# EAGLE schematic esplash (EAGLE 9.2.2)
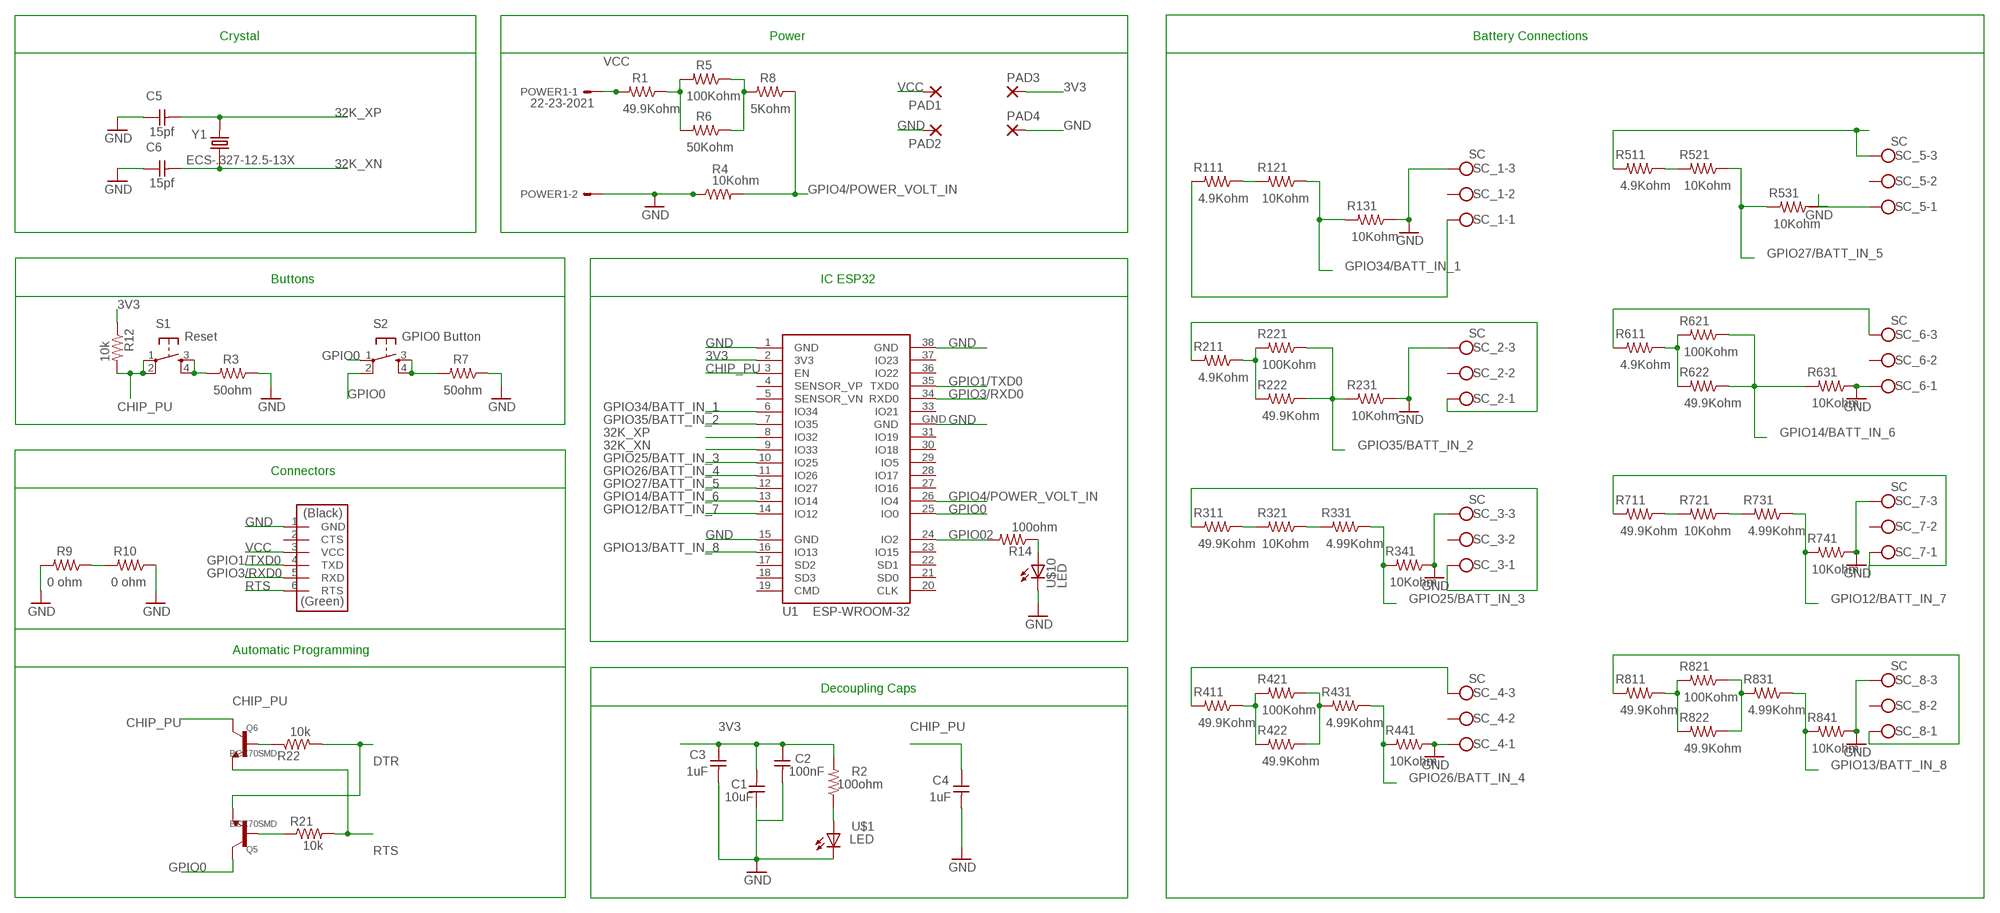
[diagram p0: schematic, sheet 1]

## Parts
C1  10uF  CAP-UNPOLARIZEDFAB  [C1206FAB]
C2  100nF  CAP-UNPOLARIZEDFAB  [C1206FAB]
C3  1uF  CAP-UNPOLARIZEDFAB  [C1206FAB]
C4  1uF  CAP-UNPOLARIZEDFAB  [C1206FAB]
C5  15pf  CAP-UNPOLARIZEDFAB  [C1206FAB]
C6  15pf  CAP-UNPOLARIZEDFAB  [C1206FAB]
PAD1  2,15/1,0  [2,15/1,0]
PAD2  2,15/1,0  [2,15/1,0]
PAD3  2,15/1,0  [2,15/1,0]
PAD4  2,15/1,0  [2,15/1,0]
POWER1  22-23-2021  [22-23-2021]
Q5  BCX70SMD  [SOT23]
Q6  BCX70SMD  [SOT23]
R1  49.9Kohm  RES-US1206FAB  [R1206FAB]
R2  100ohm  RES-US1206  [R1206]
R3  50ohm  RES-US1206FAB  [R1206FAB]
R4  10Kohm  RES-US1206FAB  [R1206FAB]
R5  100Kohm  RES-US1206FAB  [R1206FAB]
R6  50Kohm  RES-US1206FAB  [R1206FAB]
R7  50ohm  RES-US1206FAB  [R1206FAB]
R8  5Kohm  RES-US1206FAB  [R1206FAB]
R9  0 ohm  RES-US1206FAB  [R1206FAB]
R10  0 ohm  RES-US1206FAB  [R1206FAB]
R12  10k  RES-US1206  [R1206]
R14  100ohm  RES-US1206  [R1206]
R21  10k  RES-US1206  [R1206]
R22  10k  RES-US1206  [R1206]
R111  4.9Kohm  RES-US1206FAB  [R1206FAB]
R121  10Kohm  RES-US1206FAB  [R1206FAB]
R131  10Kohm  RES-US1206FAB  [R1206FAB]
R211  4.9Kohm  RES-US1206FAB  [R1206FAB]
R221  100Kohm  RES-US1206FAB  [R1206FAB]
R222  49.9Kohm  RES-US1206FAB  [R1206FAB]
R231  10Kohm  RES-US1206FAB  [R1206FAB]
R311  49.9Kohm  RES-US1206FAB  [R1206FAB]
R321  10Kohm  RES-US1206FAB  [R1206FAB]
R331  4.99Kohm  RES-US1206FAB  [R1206FAB]
R341  10Kohm  RES-US1206FAB  [R1206FAB]
R411  49.9Kohm  RES-US1206FAB  [R1206FAB]
R421  100Kohm  RES-US1206FAB  [R1206FAB]
R422  49.9Kohm  RES-US1206FAB  [R1206FAB]
R431  4.99Kohm  RES-US1206FAB  [R1206FAB]
R441  10Kohm  RES-US1206FAB  [R1206FAB]
R511  4.9Kohm  RES-US1206FAB  [R1206FAB]
R521  10Kohm  RES-US1206FAB  [R1206FAB]
R531  10Kohm  RES-US1206FAB  [R1206FAB]
R611  4.9Kohm  RES-US1206FAB  [R1206FAB]
R621  100Kohm  RES-US1206FAB  [R1206FAB]
R622  49.9Kohm  RES-US1206FAB  [R1206FAB]
R631  10Kohm  RES-US1206FAB  [R1206FAB]
R711  49.9Kohm  RES-US1206FAB  [R1206FAB]
R721  10Kohm  RES-US1206FAB  [R1206FAB]
R731  4.99Kohm  RES-US1206FAB  [R1206FAB]
R741  10Kohm  RES-US1206FAB  [R1206FAB]
R811  49.9Kohm  RES-US1206FAB  [R1206FAB]
R821  100Kohm  RES-US1206FAB  [R1206FAB]
R822  49.9Kohm  RES-US1206FAB  [R1206FAB]
R831  4.99Kohm  RES-US1206FAB  [R1206FAB]
R841  10Kohm  RES-US1206FAB  [R1206FAB]
RTS  FTDI-SMD-HEADER  [1X06SMD]
S1  Reset  6MM_SWITCH6MM_SWITCH  [6MM_SWITCH]
S2  GPIO0 Button  6MM_SWITCH6MM_SWITCH  [6MM_SWITCH]
SC_1  SC  W237-103  [W237-103]
SC_2  SC  W237-103  [W237-103]
SC_3  SC  W237-103  [W237-103]
SC_4  SC  W237-103  [W237-103]
SC_5  SC  W237-103  [W237-103]
SC_6  SC  W237-103  [W237-103]
SC_7  SC  W237-103  [W237-103]
SC_8  SC  W237-103  [W237-103]
U1  ESP-WROOM-32  [ESP-WROOM-32]
U$1  LED  [LED1206]
U$10  LED  [LED1206]
Y1  ECS-.327-12.5-13X  [XTAL_ECS-.327-12.5-13X]

## Nets
3V3: C1.2 C2.1 C3.1 PAD3.1(P) R2.2 R12.1 U1.2(3V3)
32K_XN: C6.2 U1.9(IO33) Y1.1
32K_XP: C5.2 U1.8(IO32) Y1.2
CHIP_PU: C4.1 Q6.3(C) R12.2 S1.1(P) S1.2(P1) U1.3(EN)
DTR: Q5.2(E) R22.2
GND: C1.1 C2.2 C3.2 C4.2 C5.1 C6.1 PAD2.1(P) PAD4.1(P) POWER1.2 R3.1 R4.1 R7.1 R9.2 R10.1 R131.1 R231.1 R341.1 R441.1 R531.1 R631.1 R741.1 R841.1 RTS.1(GND) SC_1.3 SC_2.3 SC_3.3 SC_4.1 SC_5.1 SC_6.1 SC_7.3 SC_8.3 U1.1(GND) U1.15(GND) U1.38(GND) U1.GND U$1.2(C) U$10.2(C)
GPIO0: Q5.3(C) S2.1(P) S2.2(P1) U1.25(IO0)
GPIO1/TXD0: RTS.4(TXD) U1.35(TXD0)
GPIO02: R14.2 U1.24(IO2)
GPIO3/RXD0: RTS.5(RXD) U1.34(RXD0)
GPIO4/POWER_VOLT_IN: R4.2 R8.1 U1.26(IO4)
GPIO12/BATT_IN_7: R731.1 R741.2 U1.14(IO12)
GPIO13/BATT_IN_8: R831.1 R841.2 U1.16(IO13)
GPIO14/BATT_IN_6: R621.1 R622.1 R631.2 U1.13(IO14)
GPIO25/BATT_IN_3: R331.1 R341.2 U1.10(IO25)
GPIO26/BATT_IN_4: R431.1 R441.2 U1.11(IO26)
GPIO27/BATT_IN_5: R521.1 R531.2 U1.12(IO27)
GPIO34/BATT_IN_1: R121.1 R131.2 U1.6(IO34)
GPIO35/BATT_IN_2: R221.1 R222.1 R231.2 U1.7(IO35)
N$2: R1.1 R5.2 R6.2
N$6: R3.2 S1.3(S) S1.4(S1)
N$8: R111.1 R121.2
N$10: R14.1 U$10.1(A)
N$12: R111.2 SC_1.1
N$13: R5.1 R6.1 R8.2
N$14: R211.2 SC_2.1
N$16: R611.2 SC_6.3
N$18: R9.1 R10.2
N$19: R2.1 U$1.1(A)
N$20: R211.1 R221.2 R222.2
N$21: R7.2 S2.3(S) S2.4(S1)
N$22: R311.2 SC_3.1
N$24: R311.1 R321.2
N$26: Q5.1(B) R21.1
N$30: R321.1 R331.2
N$32: R411.2 SC_4.3
N$33: R411.1 R421.2 R422.2
N$34: Q6.1(B) R22.1
N$35: R421.1 R422.1 R431.2
N$37: R511.1 R521.2
N$38: R511.2 SC_5.3
N$42: R611.1 R621.2 R622.2
N$43: R711.2 SC_7.1
N$44: R711.1 R721.2
N$46: R721.1 R731.2
N$47: R811.2 SC_8.1
N$48: R811.1 R821.2 R822.2
N$49: R821.1 R822.1 R831.2
RTS: Q6.2(E) R21.2 RTS.6(RTS)
VCC: PAD1.1(P) POWER1.1 R1.2 RTS.3(VCC)
Unconnected: RTS.2(CTS) SC_1.2 SC_2.2 SC_3.2 SC_4.2 SC_5.2 SC_6.2 SC_7.2 SC_8.2 U1.4(SENSOR_VP) U1.5(SENSOR_VN) U1.17(SD2) U1.18(SD3) U1.19(CMD) U1.20(CLK) U1.21(SD0) U1.22(SD1) U1.23(IO15) U1.27(IO16) U1.28(IO17) U1.29(IO5) U1.30(IO18) U1.31(IO19) U1.33(IO21) U1.36(IO22) U1.37(IO23)

## Notes on the sheet
- Crystal | Power | Battery Connections
- Buttons | IC ESP32
- Connectors
- Automatic Programming
- Decoupling Caps

## Library data of the parts
C1-C6 = fab:CAP-UNPOLARIZED
PAD1-PAD4 = wirepad:2,15/1,0: THROUGH-HOLE PAD
POWER1 = con-molex:22-23-2021: .100" (2.54mm) Center Header - 2 Pin; MF: MOLEX; MPN: 22-23-2021; OC_FARNELL: 1462926; OC_NEWARK: 25C3832
Q5 Q6 = transistor:BCX70SMD: NPN TRANSISTOR
R1-R10 R12 R14 R21 R22 R111 R121 R131 R211 R221 R222 R231 R311 R321 R331 R341 R411 R421 R422 R431 R441 R511 R521 R531 R611 R621 R622 R631 R711 R721 R731 R741 R811 R821 R822 R831 R841 = fab:RES-US: Resistor (US Symbol) Variants with postfix FAB are widened to allow the routing of internal traces
RTS = fab:FTDI-SMD-HEADER
S1 S2 = fab:6MM_SWITCH: OMRON SWITCH
SC_1-SC_8 = con-wago-500:W237-103: WAGO SCREW CLAMP; MPN: 237-103; OC_FARNELL: unknown; OC_NEWARK: 18M7116
U1 = esp32:ESP-WROOM-32: Espressif Systems ESP-WROOM-32
U$1 U$10 = fab:LED: LED
Y1 = ECS-.327-12.5-13X:ECS-.327-12.5-13X: Crystal Cylindrical Can, Radial; AVAILABILITY: Unavailable; DESCRIPTION: 32.768kHz ±20ppm Crystal 12.5pF 35 kOhms Cylindrical Can, Radial; MF: ECS Inc.; MP: ECS-.327-12.5-13X; PACKAGE: Cylindrical Can Radial ECS International; PRICE: None